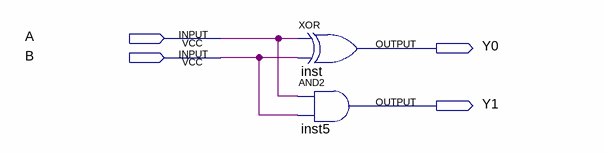
[diagram p0: schematic sheet]
// Quartus schematic HalfAdder.bdf as structural Verilog: 2 symbols, 4 pins
module HalfAdder (
  input  A,
  input  B,
  output Y0,
  output Y1
);

  xor inst (Y0, A, B);
  and inst5 (Y1, A, B);
endmodule
